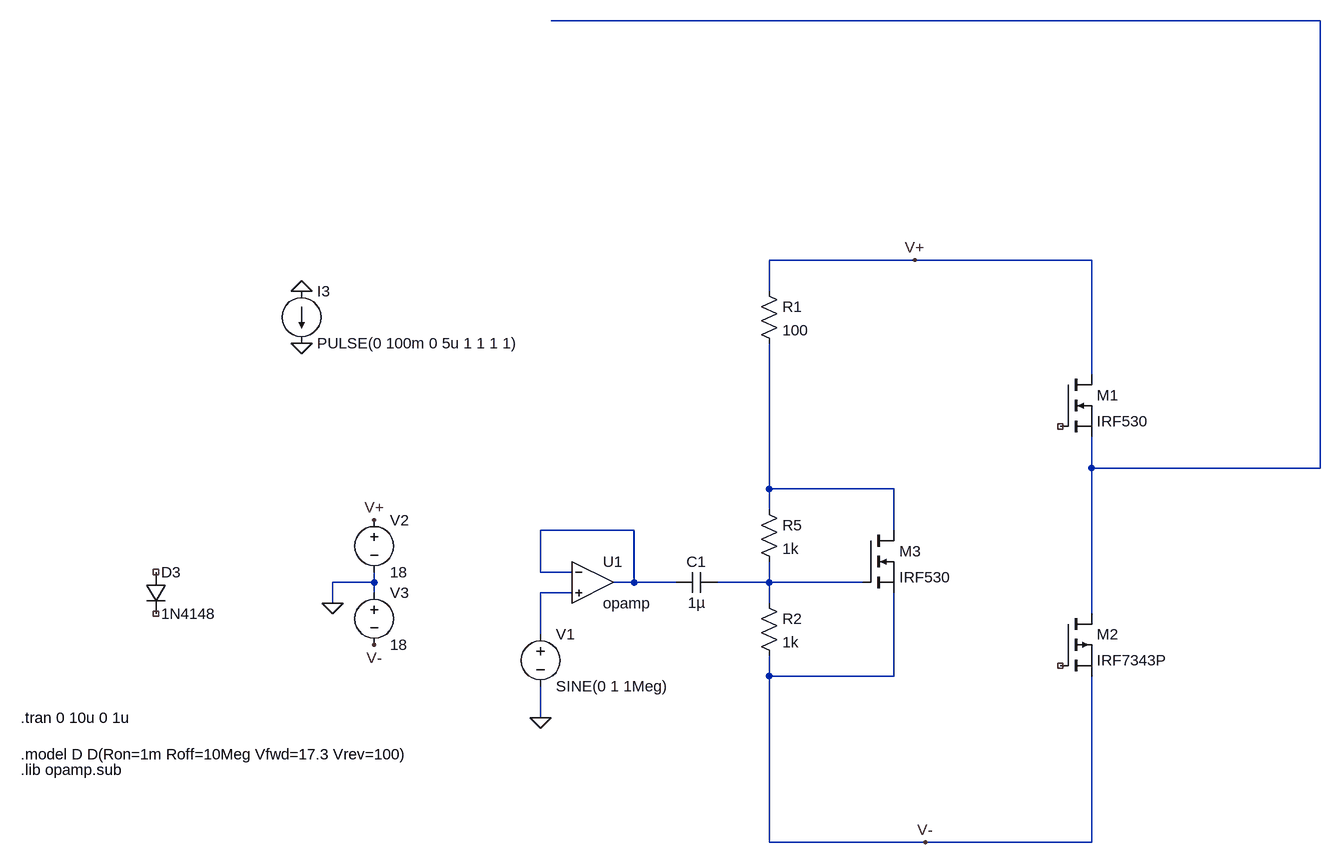
[diagram p0: schematic buffer.asc]
buffer.asc, the LTspice schematic file:
Version 4
SHEET 1 1576 940
WIRE 976 -528 -208 -528
WIRE 352 -160 128 -160
WIRE 624 -160 352 -160
WIRE 128 -112 128 -160
WIRE 624 16 624 -160
WIRE 624 160 624 112
WIRE 976 160 976 -528
WIRE 976 160 624 160
WIRE 128 192 128 -32
WIRE 320 192 128 192
WIRE 128 224 128 192
WIRE -80 256 -224 256
WIRE 320 256 320 192
WIRE -224 320 -224 256
WIRE -176 320 -224 320
WIRE -480 336 -480 320
WIRE -480 336 -544 336
WIRE -80 336 -80 256
WIRE -80 336 -112 336
WIRE -16 336 -80 336
WIRE 128 336 128 304
WIRE 128 336 48 336
WIRE 272 336 128 336
WIRE -480 352 -480 336
WIRE -176 352 -224 352
WIRE -544 368 -544 336
WIRE 128 368 128 336
WIRE 624 384 624 160
WIRE -224 416 -224 352
WIRE 128 480 128 448
WIRE 320 480 320 352
WIRE 320 480 128 480
WIRE -224 544 -224 496
WIRE 128 736 128 480
WIRE 368 736 128 736
WIRE 624 736 624 480
WIRE 624 736 368 736
FLAG 352 -160 V+
FLAG 368 736 V-
FLAG -224 544 0
FLAG -544 368 0
FLAG -480 432 V-
FLAG -480 240 V+
FLAG -592 -32 0
FLAG -592 -112 0
SYMBOL OpAmps\\opamp -144 272 R0
SYMATTR InstName U1
SYMBOL voltage -224 400 R0
WINDOW 123 0 0 Left 0
WINDOW 39 0 0 Left 0
SYMATTR InstName V1
SYMATTR Value SINE(0 1 1Meg)
SYMBOL voltage -480 224 R0
WINDOW 123 0 0 Left 0
WINDOW 39 0 0 Left 0
SYMATTR InstName V2
SYMATTR Value 18
SYMBOL voltage -480 336 R0
WINDOW 123 0 0 Left 0
WINDOW 39 0 0 Left 0
SYMATTR InstName V3
SYMATTR Value 18
SYMBOL diode -832 320 R0
SYMATTR InstName D3
SYMATTR Value 1N4148
SYMBOL current -592 -112 R0
WINDOW 123 0 0 Left 0
WINDOW 39 0 0 Left 0
SYMATTR InstName I3
SYMATTR Value PULSE(0 100m 0 5u 1 1 1 1)
SYMBOL cap 48 320 R90
WINDOW 0 0 32 VBottom 2
WINDOW 3 32 32 VTop 2
SYMATTR InstName C1
SYMATTR Value 1µ
SYMBOL nmos 576 16 R0
SYMATTR InstName M1
SYMATTR Value IRF530
SYMBOL pmos 576 384 R0
SYMATTR InstName M2
SYMATTR Value IRF7343P
SYMBOL res 112 352 R0
SYMATTR InstName R2
SYMATTR Value 1k
SYMBOL res 112 208 R0
SYMATTR InstName R5
SYMATTR Value 1k
SYMBOL nmos 272 256 R0
SYMATTR InstName M3
SYMATTR Value IRF530
SYMBOL res 112 -128 R0
SYMATTR InstName R1
SYMATTR Value 100
TEXT -1024 544 Left 2 !.tran 0 10u 0 1u
TEXT -1024 600 Left 2 !.model D D(Ron=1m Roff=10Meg Vfwd=17.3 Vrev=100)
TEXT -1024 624 Left 2 !.lib opamp.sub

The netlist it stands for:
* buffer.asc
XU1 N003 N005 N003 opamp Aol=100K GBW=10Meg  ; pins invin noninvin out
V1 N005 0 SINE(0 1 1Meg)
V2 V+ 0 18
V3 0 V- 18
D3 NC_01 NC_02 1N4148
I3 0 0 PULSE(0 100m 0 5u 1 1 1 1)
C1 N004 N003 1µ
M1 V+ NC_03 N001 N001 IRF530
M2 N001 NC_04 V- V- IRF7343P
R2 N004 V- 1k
R5 N002 N004 1k
M3 N002 N004 V- V- IRF530
R1 V+ N002 100
.model D D
.lib standard.dio
.model NMOS NMOS
.model PMOS PMOS
.lib standard.mos
.tran 0 10u 0 1u
.model D D(Ron=1m Roff=10Meg Vfwd=17.3 Vrev=100)
.lib opamp.sub
.backanno
.end